# EAGLE design Arduino-DRA818V-TX (EAGLE 7.7.0)
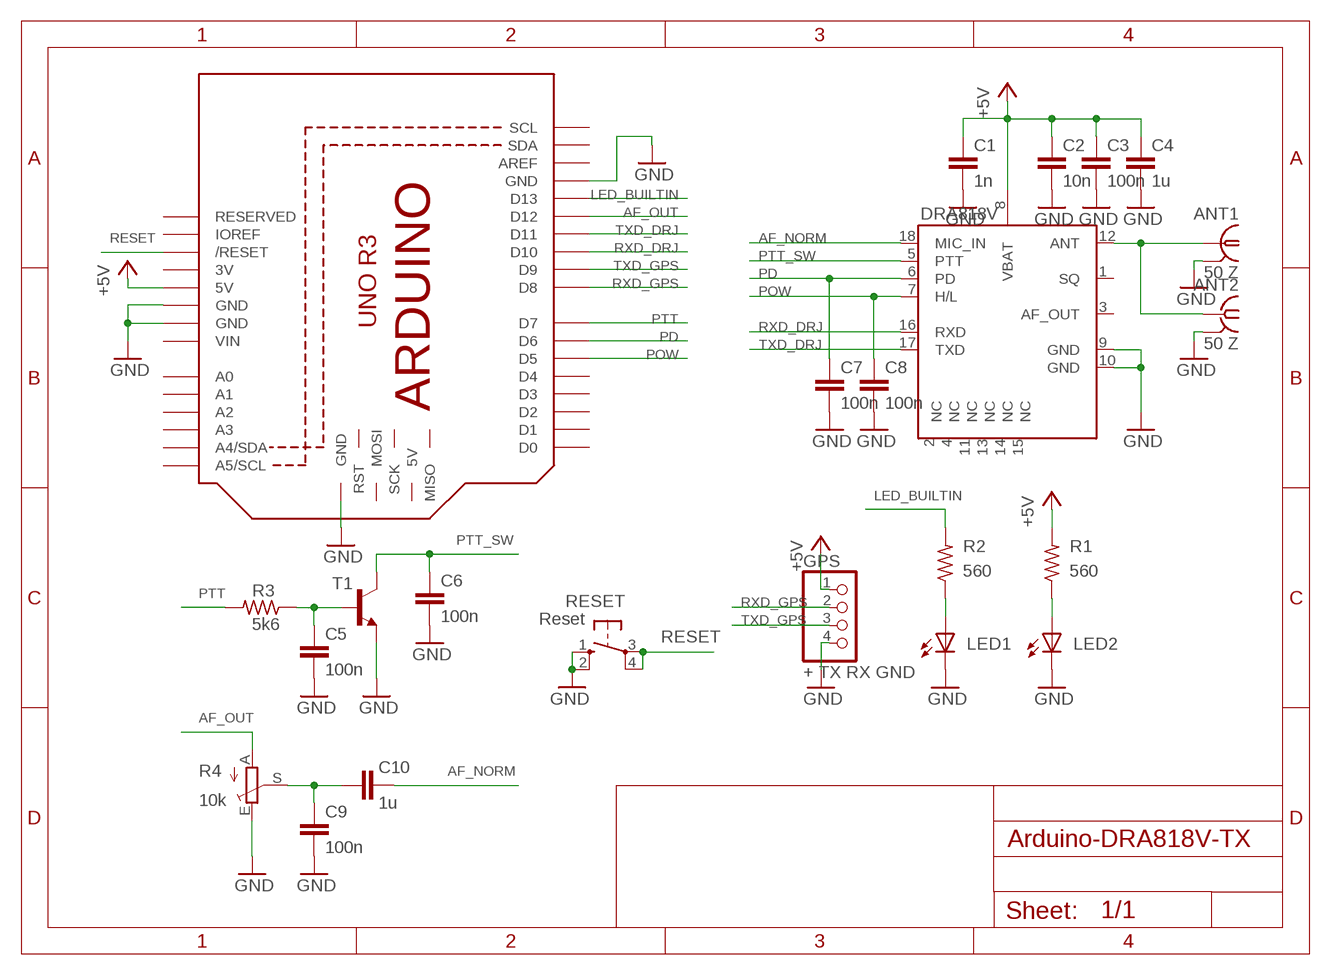
[diagram p0: schematic, sheet 1]

## Parts
ANT1  50 Z  LTI-SASF54GT  [LTI-SASF54GT]
ANT2  50 Z  SMA-142-0701-801/806  [J502-ND-142-0701-801/806]
C1  1n  C-EUC0805  [C0805]
C2  10n  C-EUC0805  [C0805]
C3  100n  C-EUC0805  [C0805]
C4  1u  C-EUC0805  [C0805]
C5  100n  C-EUC0805  [C0805]
C6  100n  C-EUC0805  [C0805]
C7  100n  C-EUC0805  [C0805]
C8  100n  C-EUC0805  [C0805]
C9  100n  C-EUC0805  [C0805]
C10  1u  C-EUC0805  [C0805]
DRA818V  DRA818A  [DRA818A]
GPS  + TX RX GND  PINHD-1X4  [1X04]
LED1  LED3MM  [LED3MM]
LED2  LED3MM  [LED3MM]
M1  ARDUINO_R3_ICSP  [ARDUINOR3_ICSP]
R1  560  R-US_R0805  [R0805]
R2  560  R-US_R0805  [R0805]
R3  5k6  R-US_R0805  [R0805]
R4  10k  TRIM_EU-CA6V  [CA6V]
RESET  Reset  10-XX  [B3F-10XX]
T1  MMBT3904LT1-NPN-SOT23-BEC  [SOT23-BEC]

## Nets
+5V: C1.1 C2.1 C3.1 C4.1 DRA818V.8(VBAT) GPS.1 M1.5V R1.2
AF_NORM: C10.2 DRA818V.18(MIC_IN)
AF_OUT: M1.D12 R4.A
GND: ANT1.2 ANT1.3 ANT1.4 ANT1.5 ANT2.G@1 ANT2.G@2 ANT2.G@3 ANT2.G@4 C1.2 C2.2 C3.2 C4.2 C5.2 C6.2 C7.2 C8.2 C9.2 DRA818V.9(GND) DRA818V.10(GND) GPS.4 LED1.K(C) LED2.K(C) M1.GND M1.GND@1(GND) M1.GND@2(GND) M1.GND@3(GND) R4.E RESET.1(S) RESET.2(S1) T1.E
LED_BUILTIN: M1.D13 R2.2
N$5: ANT1.1 ANT2.1 DRA818V.12(ANT)
N$7: C5.1 R3.1 T1.B
N$8: LED1.A R2.1
N$9: C9.1 C10.1 R4.S
N$41: LED2.A R1.1
PD: C7.1 DRA818V.6(PD) M1.D6
POW: C8.1 DRA818V.7(H/L) M1.D5
PTT: M1.D7 R3.2
PTT_SW: C6.1 DRA818V.5(PTT) T1.C
RESET: M1.RESET(/RESET) RESET.3(P) RESET.4(P1)
RXD_DRJ: DRA818V.16(RXD) M1.D10
RXD_GPS: GPS.2 M1.D8
TXD_DRJ: DRA818V.17(TXD) M1.D11
TXD_GPS: GPS.3 M1.D9
Unconnected: DRA818V.1(SQ) DRA818V.2(NC) DRA818V.3(AF_OUT) DRA818V.4(NC) DRA818V.11(NC) DRA818V.13(NC) DRA818V.14(NC) DRA818V.15(NC) M1.5V_ICSP(5V) M1.A0 M1.A1 M1.A2 M1.A3 M1.A4(A4/SDA) M1.A5(A5/SCL) M1.AREF M1.D0 M1.D1 M1.D2 M1.D3 M1.D4 M1.IOREF M1.MISO M1.MOSI M1.RESERVED M1.RESET_ICSP(RST) M1.SCK M1.SCL M1.SDA

## Power pins joined to a net without a drawn wire
3V: M1.3V
VIN: M1.VIN

## Library data of the parts
ANT1 = con-coax:LTI-SASF54GT: SMA vertical PCB thrue hole jack Source: Lighthorse Technologies, inc. SASF54GT.pdf; OC_FARNELL: unknown; OC_NEWARK: unknown
ANT2 = con-coax:SMA-: SMA 50 Ohm End Launch Jack Receptacle - Round Contact Johnson Components Source: www.johnsoncomponents.com .. J502-ND.pdf; MF: JOHNSON COMPONENTS; MPN: 142-0701-801; OC_FARNELL: 1608592; OC_NEWARK: 90F2624
C1-C10 = resistor:C-EU: CAPACITOR, European symbol
DRA818V = dorji:DRA818A
GPS = pinhead:PINHD-1X4: PIN HEADER
LED1 LED2 = adafruit:LED: LED OSRAM: - CHIPLED LG R971, LG N971, LY N971, LG Q971, LY Q971, LO R971, LY R971 LH N974, LH R974 LS Q976, LO Q976, LY Q976 LO Q996 - Hyper CHIPLED LW Q18S LB Q993, LB Q99A, LB R99A - SideLED LS A670, LO A670, LY A670, LG A670, LP A670 LB A673, LV A673, LT A673, LW A673 LH A674 LY A675 LS A676, LA A676, LO A676, LY A676, LW A676 LS A679, LY A679, LG A679 - Hyper Micro SIDELED® LS Y876, LA Y876, LO Y876, LY Y876 LT Y87S - SmartLED LW L88C, LW L88S LB L89C, LB L89S, LG L890 LS L89K, LO L89K, LY L89K LS L896, LA L896, LO L896, LY L896 - TOPLED LS T670, LO T670, LY T670, LG T670, LP T670 LSG T670, LSP T670, LSY T670, LOP T670, LYG T670 LG T671, LOG T671, LSG T671 LB T673, LV T673, LT T673, LW T673 LH T674 LS T676, LA T676, LO T676, LY T676, LB T676, LH T676, LSB T676, LW T676 LB T67C, LV T67C, LT T67C, LS T67K, LO T67K, LY T67K, LW E67C LS E67B, LA E67B, LO E67B, LY E67B, LB E67C, LV E67C, LT E67C LW T67C LS T679, LY T679, LG T679 LS T770, LO T770, LY T770, LG T770, LP T770 LB T773, LV T773, LT T773, LW T773 LH T774 LS E675, LA E675, LY E675, LS T675 LS T776, LA T776, LO T776, LY T776, LB T776 LHGB T686 LT T68C, LB T68C - Hyper Mini TOPLED® LB M676 - Mini TOPLED Santana® LG M470 LS M47K, LO M47K, LY M47K Source: http://www.osram.convergy.de/
M1 = adafruit:ARDUINO_R3_ICSP
R1-R3 = resistor:R-US_: RESISTOR, American symbol
R4 = pot:TRIM_EU-: POTENTIOMETER
RESET = switch-omron:10-XX: OMRON SWITCH; MPN: B3F-1000; OC_FARNELL: 176432; OC_NEWARK: 36M3542
T1 = transistor:*-NPN-: NPN Transistror BF959 corrected 2008.03.06

## Board
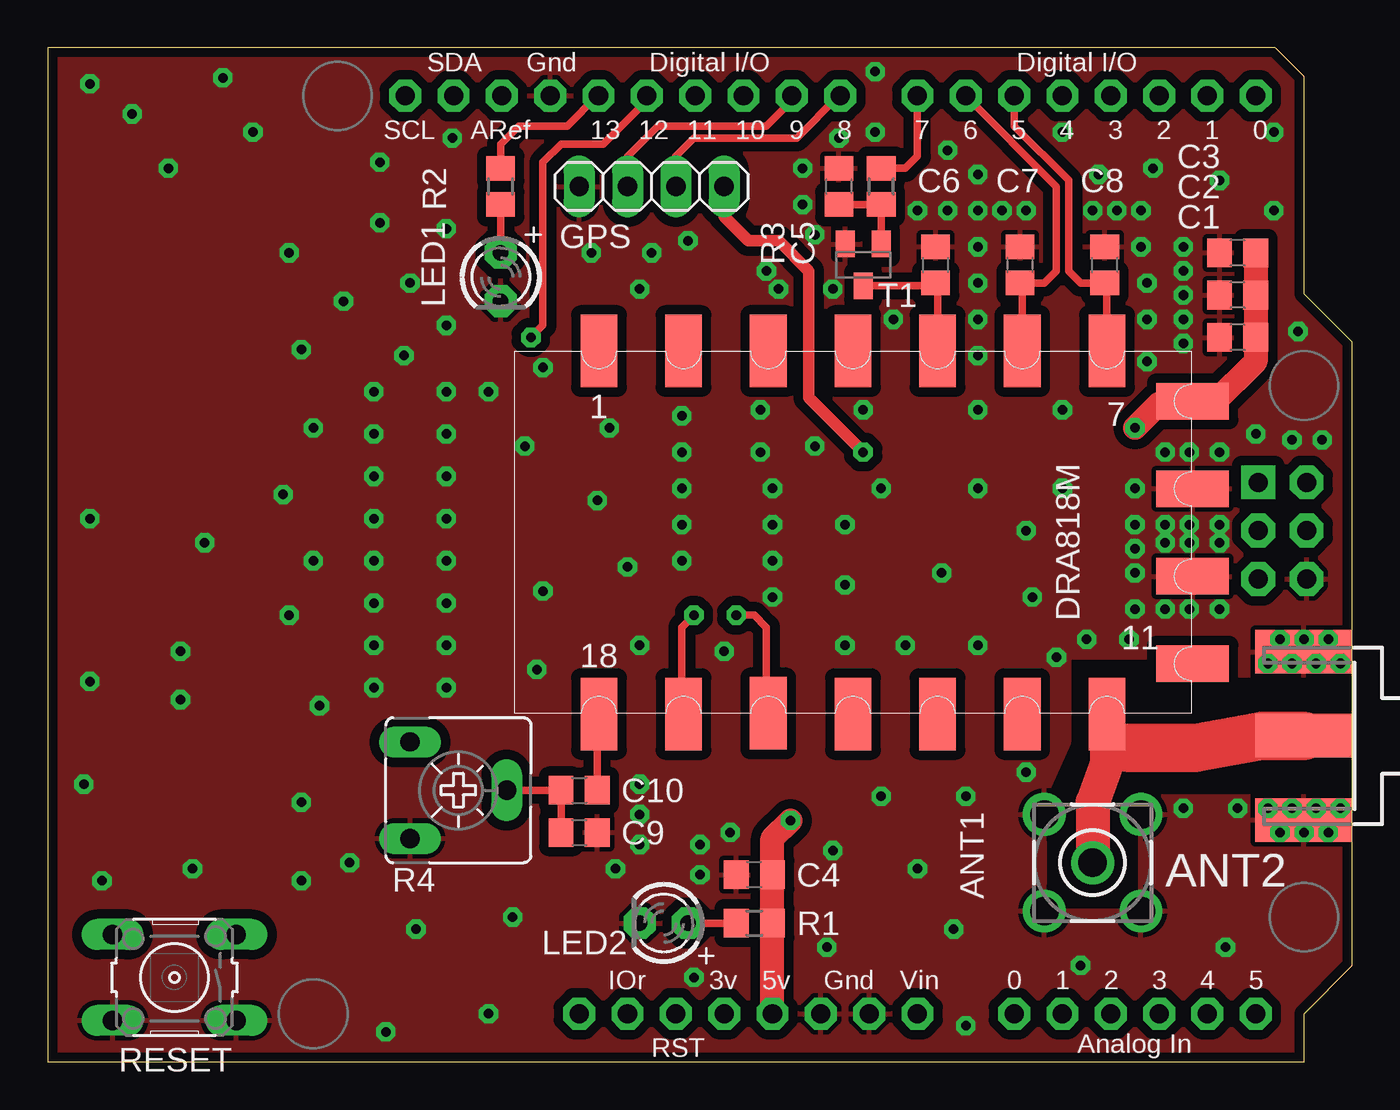
[diagram p1: board, top side]
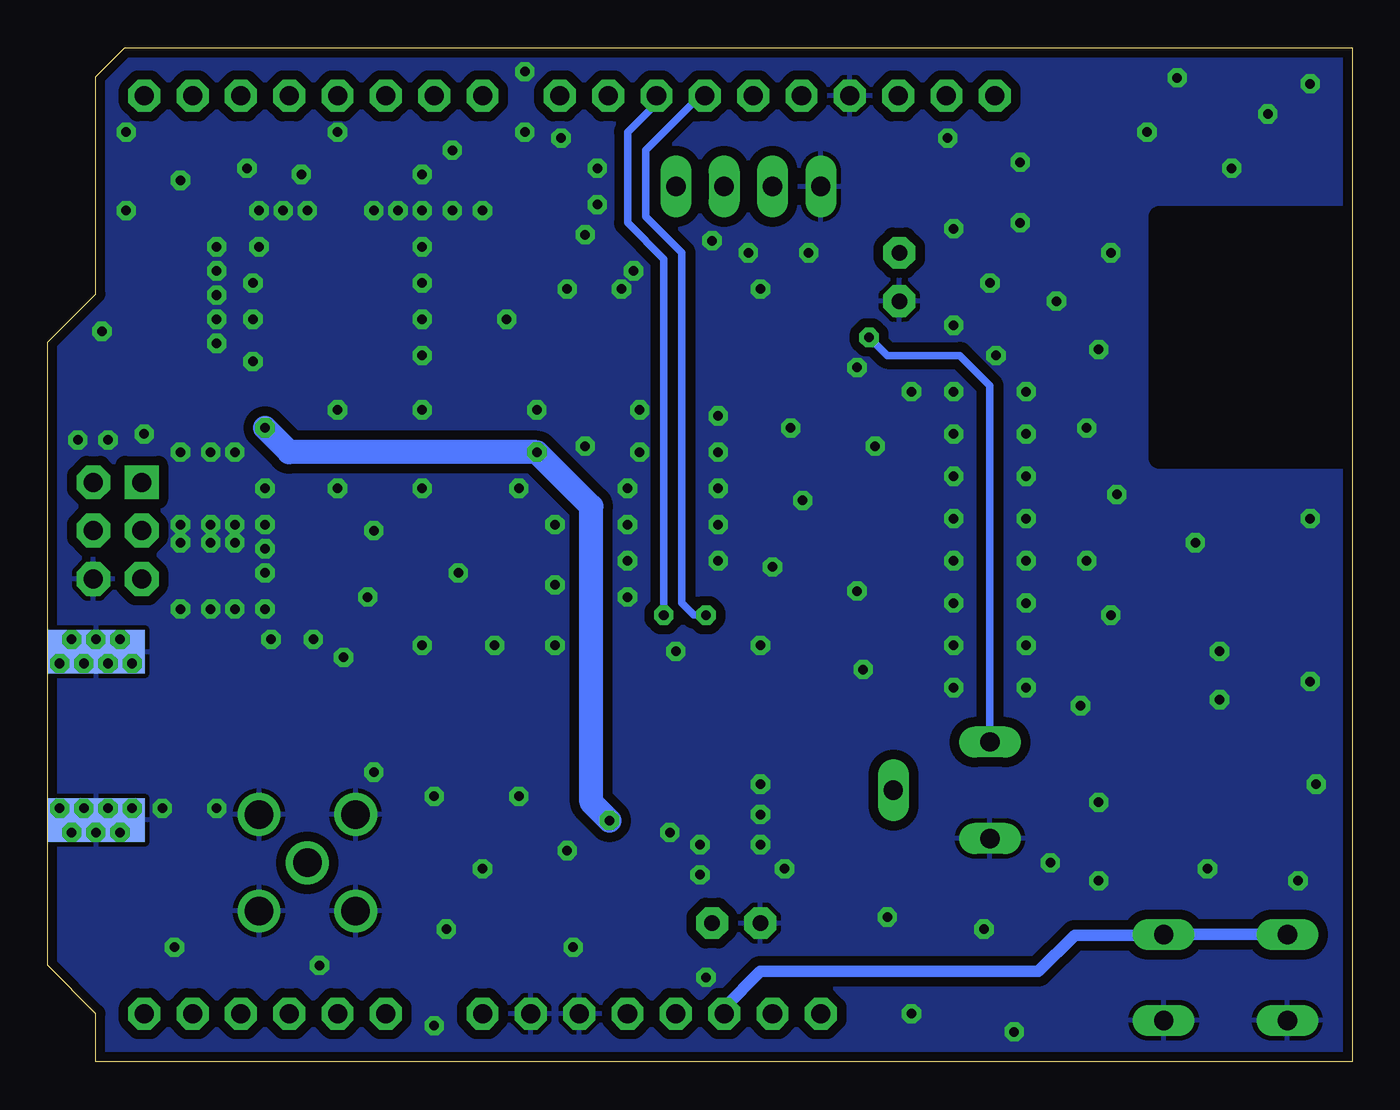
[diagram p2: board, bottom side, seen from below]

Size 68.58 x 53.34 mm. Coordinates in mm from the lower left corner, seen from the top.
Copper layers (1*16): Top 0.035mm / dielectric 1.5mm / Bottom 0.035mm
Design rules "SparkFun": minimum track width 8mil, minimum drill 20mil, track to track 8mil, track to pad 8mil, pad to pad 8mil, via to via 8mil, smd to smd 8mil, copper to edge 10mil, drill to drill 8mil, minimum pad ring 12mil, minimum via ring 10mil, stop-mask expansion 4mil, vias tented up to drill 25mil, thermal gap 10mil

### Footprints (pad centres in the part's own frame; a part is rotated, then mirrored left to right if it is on the bottom)
LTI-SASF54GT = drill 1.5 pad 2.2: 1 0,0; 2 -2.54,2.54; 3 2.54,2.54; 4 2.54,-2.54; 5 -2.54,-2.54
J502-ND-142-0701-801/806 = smd 5.08 x 2.286: 1 2.565,0; G@1 2.565,4.42; G@2 2.565,-4.42 | smd 5.08 x 2.286 bottom: G@3 2.565,4.42; G@4 2.565,-4.42
C0805 = smd 1.3 x 1.5: 1 -0.95,0; 2 0.95,0
DRA818A = smd 3.81 x 1.93: 1 -9.45,-13.25; 2 -9.45,-8.8; 3 -9.45,-4.35; 4 -9.45,0.1; 5 -9.45,4.55; 6 -9.45,9; 7 -9.45,13.45; 12 9.65,13.45; 13 9.65,9; 14 9.65,4.55; 15 9.65,0.1; 16 9.6,-4.35; 17 9.65,-8.8; 18 9.65,-13.25 | smd 1.93 x 3.81: 8 -6.8,17.95; 9 -2.2,17.95; 10 2.4,17.95; 11 7,17.95
1X04 = drill 1.016 long: 1 -3.81,0; 2 -1.27,0; 3 1.27,0; 4 3.81,0
LED3MM = drill 0.813 pad 1.676 octagon: A -1.27,0; K 1.27,0
ARDUINOR3_ICSP = drill 1 pad 1.676 octagon: 3V 35.56,2.54; 5V 38.1,2.54; A0 50.8,2.54; A1 53.34,2.54; A2 55.88,2.54; A3 58.42,2.54; A4 60.96,2.54; A5 63.5,2.54; AREF 23.876,50.8; D0 63.5,50.8; D1 60.96,50.8; D2 58.42,50.8; D3 55.88,50.8; D4 53.34,50.8; D5 50.8,50.8; D6 48.26,50.8; D7 45.72,50.8; D8 41.656,50.8; D9 39.116,50.8; D10 36.576,50.8; D11 34.036,50.8; D12 31.496,50.8; D13 28.956,50.8; GND 26.416,50.8; GND@1 43.18,2.54; GND@2 40.64,2.54; IOREF 30.48,2.54; RESERVED 27.94,2.54; RESET 33.02,2.54; SCL 18.796,50.8; SDA 21.336,50.8; VIN 45.72,2.54 | drill 1 pad 1.778 octagon: 5V_ICSP 66.167,30.48; GND@3 66.167,25.4; MOSI 66.167,27.94; RESET_ICSP 63.627,25.4; SCK 63.627,27.94 | drill 1 pad 1.778 square: MISO 63.627,30.48
R0805 = smd 1.3 x 1.5: 1 -0.95,0; 2 0.95,0
CA6V = drill 1.016 long: A -2.54,-2.54; E 2.54,-2.54; S 0,2.54
B3F-10XX = drill 1.016 long: 1 -3.251,2.261; 2 3.251,2.261; 3 -3.251,-2.261; 4 3.251,-2.261
SOT23-BEC = smd 1 x 1.4: B -0.95,-1.1; C 0,1.1; E 0.95,-1.1

### Placement (x,y rotation side)
ANT1  54.93,10.48 0 top
ANT2  68.58,17.15 180 top
C1  62.55,38.1 180 top
C2  62.55,40.32 180 top
C3  62.55,42.55 180 top
C4  37.15,9.84 180 top
C5  41.59,46.04 90 top
C6  46.67,41.91 90 top
C7  51.12,41.91 90 top
C8  55.56,41.91 90 top
C9  27.94,12.06 0 top
C10  27.94,14.29 0 top
DRA818V  42.23,27.94 270 top
GPS  31.75,46.04 180 top
LED1  23.81,41.28 270 top
LED2  32.39,7.3 180 top
M1  0,0 0 top
R1  37.15,7.3 0 top
R2  23.81,46.04 90 top
R3  43.81,46.04 90 top
R4  21.59,14.29 270 top
RESET  6.67,4.45 180 top
T1  42.86,41.91 180 top

### Tracks (layer width: path | path; a pad name or v marks a point on that pad's centre or on a via)
+5V  (via drill 0.5 pad 1.02)
  Top 0.61: GPS.1 35.56,44.45 36.83,43.18 38.42,43.18 40,41.59 40,34.92 v42.86,32.07
  Top 1.27: M1.5V R1.2 C4.1 38.1,11.74 v39.05,12.7 | v57.15,33.34 58.42,34.61 60.05,34.61 DRA818V.8 60.31,34.61 61.28,34.61 63.5,36.83 C1.1 C2.1 C3.1
  Bottom 1.27: v39.05,12.7 40,13.65 40,29.21 v42.86,32.07 55.88,32.07 v57.15,33.34
AF_NORM
  Top 0.406: C10.2 28.89,18.2 DRA818V.18
AF_OUT  (via drill 0.5 pad 1.02)
  Top 0.406: M1.D12 31.5,50.55 29.21,48.26 26.99,48.26 26.04,47.31 26.04,38.73 v25.4,38.1
  Bottom 0.406: v25.4,38.1 24.45,37.15 20.64,37.15 19.05,35.56 R4.A
GND  (via drill 0.5 pad 0.61)
  other vias: 59.69,42.86 59.69,41.59 59.69,40.32 59.69,39.05 59.69,37.78 57.78,36.83 57.78,39.05 57.47,42.86 54.93,44.77 56.2,44.77 57.47,44.77 53.34,48.89 64.45,48.89 64.45,44.77 57.78,40.96 55.24,46.67 58.1,46.99 51.44,44.77 45.72,44.77 47.31,44.77 48.89,44.77 50.16,44.77 48.89,42.86 48.89,40.96 48.89,39.05 48.89,37.15 47.31,47.94 48.89,46.67 44.45,39.05 39.69,46.99 39.69,45.08 40.32,43.5 41.59,48.58 43.5,48.89 43.5,52.07 37.78,41.59 38.42,40.64 37.47,34.29 40.32,32.39 42.86,34.29 48.89,34.29 53.34,34.29 53.34,30.16 48.89,30.16 43.81,30.16 41.91,28.26 38.1,28.26 38.1,30.16 57.15,30.16 58.74,32.07 61.59,32.07 61.59,28.26 58.74,28.26 58.74,27.3 61.59,27.3 61.59,23.81 58.74,23.81 57.15,25.72 57.15,23.81 57.15,28.26 57.15,26.99 60.01,32.07 60.01,27.3 60.01,23.81 60.01,28.26 64.77,22.23 66.04,22.23 67.31,22.23 64.13,20.95 65.41,20.95 66.67,20.95 64.13,13.34 64.77,12.06 65.41,13.34 66.04,12.06 66.67,13.34 67.31,12.06 67.94,13.34 67.94,20.95 62.55,13.34 59.69,13.34 51.44,15.24 53.02,21.27 54.61,22.23 56.83,22.23 34.29,9.84 34.29,11.43 35.88,12.06 31.11,11.43 31.11,13.02 31.11,14.6 29.85,10.16 41.28,11.11 38.1,26.35 38.1,24.45 35.56,21.59 41.91,21.91 45.08,21.91 48.89,21.91 41.91,25.08 31.11,21.91 33.34,26.35 33.34,28.26 33.34,30.16 33.34,32.07 33.34,33.97 37.47,32.07 20.96,35.24 20.96,33.02 20.96,30.8 20.96,28.58 20.96,26.35 20.96,24.13 20.96,21.91 20.96,19.69 17.14,19.69 17.14,21.91 17.14,24.13 17.14,26.35 17.14,28.58 17.14,30.8 17.14,33.02 17.14,35.24 20.96,38.73 18.73,37.15 23.18,35.24 26.04,36.51 19.37,6.98 17.78,1.59 23.18,2.54 33.97,4.45 48.26,1.91 40.96,6.03 43.81,13.97 45.72,10.16 47.62,6.98 61.91,6.03 54.29,5.08 46.99,25.72 51.44,27.94 51.75,24.45 25.08,32.39 28.89,29.53 26.04,24.77 30.48,26.03 25.72,20.64 13.34,13.65 61.59,46.36 65.72,38.42 63.5,33.02 65.41,32.7 66.99,32.7 48.26,13.97 28.57,42.55 31.75,42.55 33.66,43.18 31.11,40.64 29.53,33.34 21.27,48.58 20.96,43.81 19.05,40.96 41.28,40.64 17.46,47.31 17.46,44.13 4.45,49.85 2.22,51.44 9.21,51.75 10.79,48.89 6.35,46.99 12.7,42.55 13.34,37.47 15.56,40 12.38,29.84 2.22,28.58 12.7,23.49 6.98,21.59 6.98,19.05 8.25,27.3 2.22,20 1.91,14.6 2.86,9.52 7.62,10.16 13.34,9.52 14.29,18.73 13.97,33.34 13.97,26.35 15.88,10.48 24.45,7.62
  pour Bottom (isolate 0.5): 0.32,53.02 64.45,53.02 65.72,51.75 65.72,40.32 68.26,37.78 68.26,5.4 65.72,2.86 65.72,0.32 0.32,0.32
  pour Top (isolate 0.5): 0.32,53.02 64.45,53.02 65.72,51.75 65.72,40.32 68.26,37.78 68.26,20.32 60.01,20.32 60.01,21.27 53.66,21.27 53.66,16.83 52.39,13.97 52.39,7.94 57.47,7.94 57.47,13.97 68.26,13.97 68.26,5.08 65.72,2.54 65.72,0.32 0.32,0.32
LED_BUILTIN
  Top 0.406: M1.D13 28.89,50.8 27.3,49.21 24.76,49.21 23.81,48.26 R2.2
N$5
  Top 1.778: ANT1.1 54.93,13.65 55.68,15.67 DRA818V.12 55.68,16.71 55.88,16.51 56.83,16.51
  Top 2.54: 56.83,16.51 60.33,16.51 63.82,17.15 ANT2.1
N$7
  Top 0.406: T1.B R3.1 C5.1
N$8
  Top 0.406: R2.1 LED1.A
N$9
  Top 0.406: C9.1 C10.1 R4.S
N$41
  Top 0.406: R1.1 LED2.A
PD
  Top 0.406: DRA818V.6 51.23,40.85 C7.1 52.39,40.96 53.02,41.59 53.02,46.04 M1.D6
POW
  Top 0.406: DRA818V.7 55.68,40.84 C8.1 54.29,40.96 53.66,41.59 53.66,46.36 50.8,49.21 M1.D5
PTT
  Top 0.406: R3.2 45.08,46.99 45.72,47.62 M1.D7
PTT_SW
  Top 0.406: T1.C 46.52,40.81 C6.1 46.78,40.86 DRA818V.5
RESET
  Bottom 0.61: RESET.4 RESET.3 | RESET.3 10.44,6.71 10.48,6.67 | 10.48,6.67 9.96,6.67 RESET.3 | M1.RESET 33.02,2.86 31.11,4.76 16.51,4.76 14.61,6.67 10.48,6.67
RXD_DRJ  (via drill 0.5 pad 1.02)
  Top 0.406: v36.19,23.49 37.15,23.49 37.78,22.86 37.78,18.44 DRA818V.16
  Bottom 0.406: M1.D10 36.58,50.42 38.1,48.89 38.1,44.13 36.19,42.23 v36.19,23.49
RXD_GPS
  Top 0.406: M1.D8 41.59,50.8 39.37,48.58 33.97,48.58 33.02,47.62 GPS.2
TXD_DRJ  (via drill 0.5 pad 1.02)
  Top 0.406: v33.97,23.49 33.34,22.86 33.34,18.38 DRA818V.17
  Bottom 0.406: M1.D11 34.04,50.74 34.35,50.74 37.15,47.94 37.15,44.45 35.24,42.55 35.24,24.13 34.61,23.49 v33.97,23.49
TXD_GPS
  Top 0.406: M1.D9 39.12,50.55 37.78,49.21 32.07,49.21 30.48,47.62 GPS.3

### Text on the board
tStop: ARDUINO TX-818V SHIELD | v1.0 | www.github.com/handiko